# Altium project UHV Gate Valve Control.PrjPcb
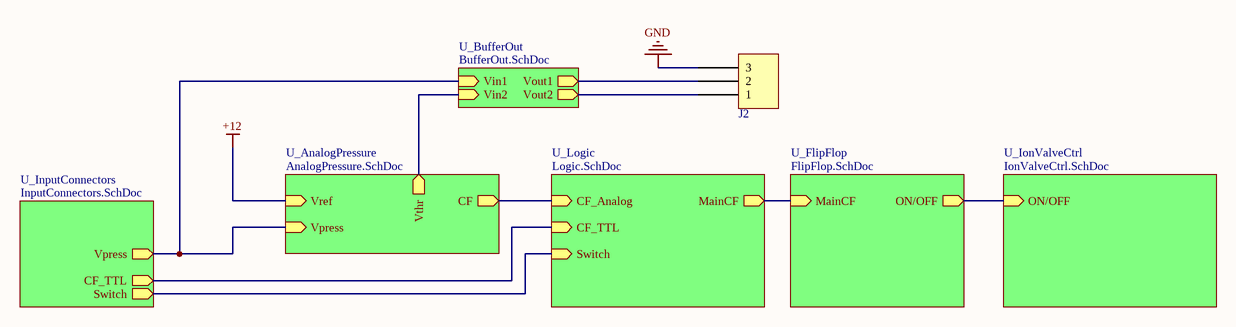
[diagram p0: MainSch.SchDoc]
7 sheets, 69 parts. Net scope: hierarchical (ports join the sheet entries above them; power ports are global).
Board file: UHVValveCtrlv1.PcbDoc
Sheets:
  MainSch.SchDoc
    U_AnalogPressure = AnalogPressure.SchDoc
    U_InputConnectors = InputConnectors.SchDoc
    U_Logic = Logic.SchDoc
    U_FlipFlop = FlipFlop.SchDoc
    U_IonValveCtrl = IonValveCtrl.SchDoc
    U_BufferOut = BufferOut.SchDoc

## Sheet MainSch.SchDoc
size A

### Parts
J2  0022272031  [MOLEX KK 0022272031]  (value not drawn)

### Sub-sheets
U_AnalogPressure = AnalogPressure.SchDoc: Vref (in), Vpress (in), CF (out), Vthr (out)
U_BufferOut = BufferOut.SchDoc: Vin1 (in), Vin2 (in), Vout1 (out), Vout2 (out)
U_FlipFlop = FlipFlop.SchDoc: MainCF (in), ON/OFF (out)
U_InputConnectors = InputConnectors.SchDoc: CF_TTL (out), Vpress (out), Switch (out)
U_IonValveCtrl = IonValveCtrl.SchDoc: ON/OFF (in)
U_Logic = Logic.SchDoc: CF_Analog (in), CF_TTL (in), Switch (in), MainCF (out)

### Nets
GND: J2.3
ON/OFF: sheet U_FlipFlop/ON/OFF, sheet U_IonValveCtrl/ON/OFF
NetC5_1: sheet U_InputConnectors/CF_TTL, sheet U_Logic/CF_TTL
NetC12_1: sheet U_Logic/MainCF, sheet U_FlipFlop/MainCF
NetINT_SWITCH_2: sheet U_InputConnectors/Switch, sheet U_Logic/Switch
NetJ1_2: sheet U_AnalogPressure/Vpress, sheet U_InputConnectors/Vpress, sheet U_BufferOut/Vin1
NetJ2_1: J2.1 ; sheet U_BufferOut/Vout2
NetJ2_2: J2.2 ; sheet U_BufferOut/Vout1
NetR1_1: sheet U_AnalogPressure/CF, sheet U_Logic/CF_Analog
NetR2_2: sheet U_AnalogPressure/Vthr, sheet U_BufferOut/Vin2

### Library data of the parts
J2 = 0022272031: CONN HEADER 3POS .100 VERT TIN; Manufacturer: Molex, LLC; Pitch: 0.100" (2.54mm); Number Of Positions: 3; Part Number: 0022272031; PartId: 9720; Supplier 1: Digi-Key; Supplier Part Number 1: WM4112-ND; ComponentLink1Description: Datasheet; ComponentLink1URL: http://www.molex.com/pdm_docs/sd/022272031_sd.pdf; ComponentLink2Description: Digi-Key Listing; ComponentLink2URL: http://www.digikey.com/product-search/en?keywords=22-27-2031; Price: 0.35; Type: Header, Unshrouded; Contact Finish: Tin; Fastening Type: Friction Lock; Number Of Rows: 1; Colour: Natural; Series: KK 6410

## Sheet AnalogPressure.SchDoc
size A
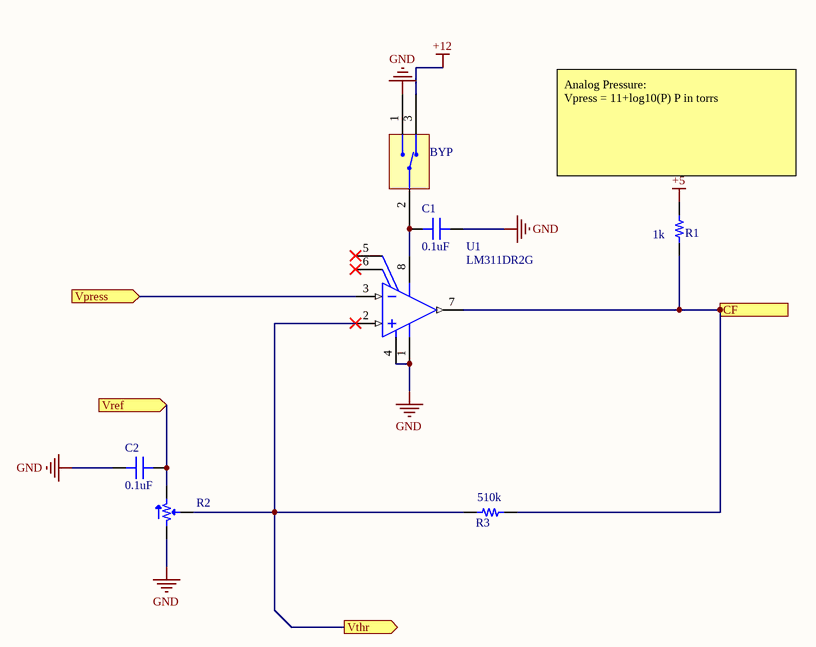
[diagram p1: AnalogPressure.SchDoc]

### Parts
BYP  CL-SB-12B-01T  [SW_CL-SB-12B-01]  (value not drawn)
C1  0.1uF  [CAP 0805/2012]
C2  0.1uF  [CAP 0805/2012]
R1  1k  [RES 1206/3216]
R2  20k  [POT MODEL91A]  (value not drawn)
R3  510k  [RES 1206/3216]
U1  LM311DR2G  [ONSC-SOIC-8-751-07_V]

### Ports
CF (out), Vpress (in), Vref (in), Vthr (out)

### Nets
+5: R1.2
+12: BYP.3(GND) C2.1 R2.3 ; port Vref
GND: BYP.1(GND) C1.2 C2.2 R2.1 U1.1(GND) U1.4(VEE)
NetBYP_2: BYP.2(GND) C1.1 U1.8(VCC)
NetJ1_2: U1.3(IN-) ; port Vpress
NetR1_1: R1.1 R3.2 U1.7(OUT) ; port CF
NetR2_2: R2.2 R3.1 U1.2(IN+) ; port Vthr

Not connected (* = marked no-connect by the designer): U1 5(BALANCE)* 6(BALANCE/STROBE)*

### Notes on the sheet
- (near R1) Analog Pressure:
  Vpress = 11+log10(P) P in torrs

### Library data of the parts
BYP = CL-SB-12B-01T: SWITCH SLIDE SPDT 200MA 12V; Manufacturer: Nidec Copal Electronics; Switch Function: On-On; Actuator Type: Standard; Switch Travel: 2.00mm; Mechanical Life: 10,000 Cycles; Part Number: CL-SB-12B-01T; PartId: 16472; Supplier 1: Digi-Key; Supplier Part Number 1: 563-1318-1-ND; ComponentLink1Description: Datasheet; ComponentLink1URL: https://www.nidec-copal-electronics.com/e/catalog/switch/cl-sb.pdf; ComponentLink2Description: Digi-Key Listing; ComponentLink2URL: https://www.digikey.com/product-detail/en/nidec-copal-electronics/CL-SB-12B-01T/563-1318-1-ND/3507878; Price: 0.9; TYPE: Slide Switches; Series: CL-SB; Circuit: SPDT; Operating Temperature: -40°C ~ 85°C
C1 C2 = CL21B104KACNNNC: CAP CER 0.1UF 25V X7R 0805; Manufacturer: Samsung Electro-Mechanics America, Inc.; TemperatureRange: -55C ~ 125C; Tolerance: 10%; Value: 0.1uF; Part Number: CL21B104KACNNNC; PartId: 5699; Supplier 1: Digi-Key; Supplier Part Number 1: 1276-1099-2-ND; ComponentLink1Description: Datasheet; ComponentLink1URL: http://www.samsungsem.com/kr/support/product-search/mlcc/CL21B104KACNNNC.jsp; ComponentLink2Description: Digi-Key listing; ComponentLink2URL: http://digikey.com/product-detail/en/CL21B104KACNNNC/1276-1099-2-ND/3886757; TemperatureCoefficient: X7R; Voltage: 25V; Price: 0.0099; Device Package: 0805 (2012 Metric); Type: -
R1 = ERJ-8ENF1001V: RES SMD 1K OHM 1% 1/4W 1206; Manufacturer: Panasonic Electronic Components; TemperatureRange: -55C ~ 155C; TemperatureCoefficient: 100ppm/C; PowerRating: 0.25W, 1/4W; Value: 1k; Part Number: ERJ-8ENF1001V; PartId: 2958; Supplier 1: Digi-Key; Supplier Part Number 1: P1.00KFTR-ND; ComponentLink1Description: Datasheet; ComponentLink1URL: http://industrial.panasonic.com/www-cgi/jvcr13pz.cgi?E+PZ+3+AOA0002+ERJ8ENF1001V+7+WW; ComponentLink2Description: Digi-Key listing; ComponentLink2URL: http://digikey.com/product-detail/en/ERJ-8ENF1001V/P1.00KFTR-ND/86206; Tolerance: 1%; Price: 0.0093; Type: Thick Film; Device Package: 1206 (3216 Metric)
R2 = 91AR20KLF: TRIMMER 20K OHM 3/8" CERMET TH; Manufacturer: TT Electronics/BI; Tolerance: 20%; PowerRating: 0.5W, 1/2W; Number Of Turns: Single; Adjustment Type: Top Adjustment; Value: 20k; Part Number: 91AR20KLF; PartId: 7167; Supplier 1: Digi-Key; Supplier Part Number 1: 987-1170-ND; ComponentLink1Description: Datasheet; ComponentLink1URL: http://www.bitechnologies.com/pdfs/91.pdf; ComponentLink2Description: Digi-Key Listing; ComponentLink2URL: http://www.digikey.ca/product-detail/en/91AR20KLF/987-1170-ND/2408748; Price: 2.25; Type: Through Hole
R3 = ERJ-8GEYJ514V: RES SMD 510K OHM 5% 1/4W 1206; Manufacturer: Panasonic Electronic Components; TemperatureRange: -55C ~ 155C; TemperatureCoefficient: 200ppm/C; PowerRating: 0.25W, 1/4W; Value: 510k; Part Number: ERJ-8GEYJ514V; PartId: 11855; Supplier 1: Digi-Key; Supplier Part Number 1: P510KETR-ND; ComponentLink1Description: Datasheet; ComponentLink1URL: http://industrial.panasonic.com/www-cgi/jvcr13pz.cgi?E+PZ+3+AOA0001+ERJ8GEYJ514V+7+WW; ComponentLink2Description: Digi-Key Listing; ComponentLink2URL: https://www.digikey.com/product-detail/en/panasonic-electronic-components/ERJ-8GEYJ514V/P510KETR-ND/21336; Tolerance: 5%; Price: 0.0045; Device Package: 1206 (3216 Metric)
U1 = CMP-1305-00058-1: Single Comparator, 5 to 30 V, 0 to 70 degC, 8-Pin SOIC, Pb-Free, Tape and Reel; Manufacturer: On Semiconductor; VCC Max (V): 30; VCC Min (V): 5; ICC Typ (mA): 2.4; ComponentLink3Description: Package Specification; ComponentLink1URL: http://www.onsemi.com/; ComponentLink1Description: Manufacturer URL; Mounting Technology: Surface Mount; PackageDescription: 8-Pin Small Outline Integrated Circuit, Body 4.9 x 3.9 mm, Pitch 1.27 mm; ComponentLink2Description: Datasheet; RoHS: TRUE; ComponentLink2URL: http://www.onsemi.com/pub_link/Collateral/LM211-D.PDF; PackageVersion: Rev. AK, 02/2011; PackageReference: SOIC-8-751-07; DatasheetVersion: Rev. 6; Packing: Tape and Reel; ComponentLink3URL: http://www.onsemi.com/pub_link/Collateral/751-07.PDF; PartNumber: LM311DR2G

## Sheet InputConnectors.SchDoc
size A
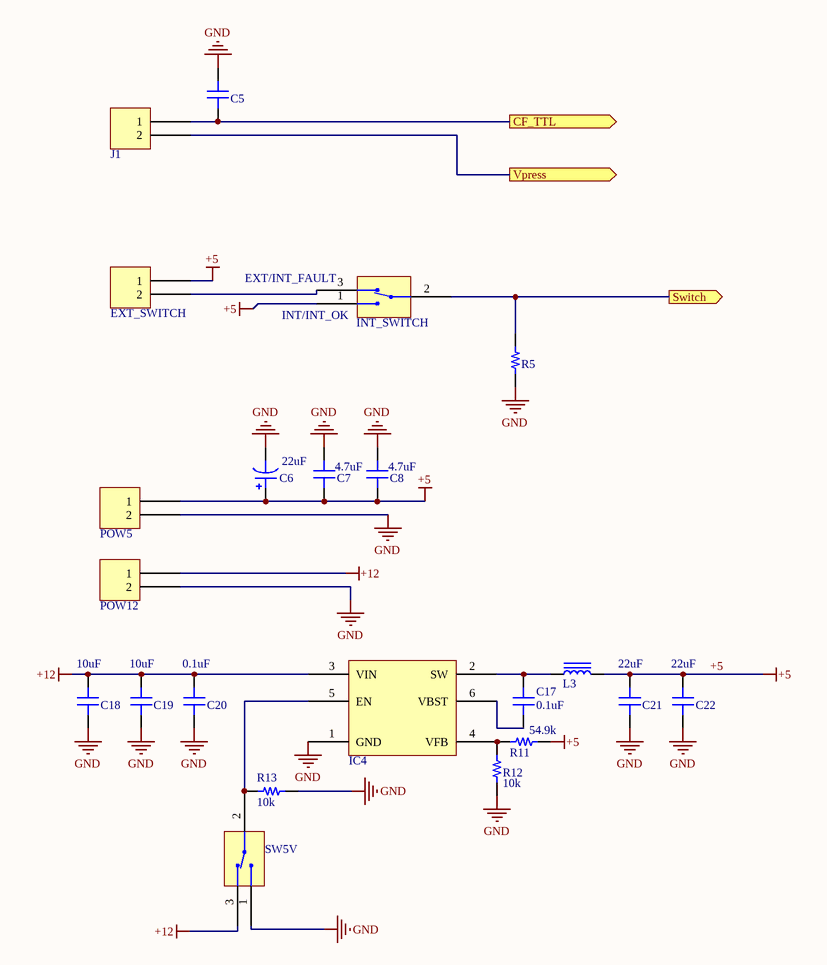
[diagram p2: InputConnectors.SchDoc]

### Parts
C5  10000pF  [CAP 0805/2012]  (value not drawn)
C6  22uF  [CAP AL TH D8 L3.5 H11.5]
C7  4.7uF  [CAP 1206/3216 - 1.0MM]
C8  4.7uF  [CAP 1206/3216 - 1.0MM]
C17  0.1uF  [CAP 0805/2012]
C18  10uF  [CAP 1206/3216]
C19  10uF  [CAP 1206/3216]
C20  0.1uF  [CAP 0805/2012]
C21  22uF  [CAP 1206/3216]
C22  22uF  [CAP 1206/3216]
EXT_SWITCH  282834-2  [TE 282834-2]  (value not drawn)
IC4  TPS563201DDCT  [TI SOT-23-6 DDC]  (value not drawn)
INT_SWITCH  CL-SB-12B-01T  [SW_CL-SB-12B-01]  (value not drawn)
J1  282834-2  [TE 282834-2]  (value not drawn)
L3  3.3uH  [WURTH WE-HCI 7050]  (value not drawn)
POW5  282834-2  [TE 282834-2]  (value not drawn)
POW12  282834-2  [TE 282834-2]  (value not drawn)
R5  10k  [RES 1206/3216]  (value not drawn)
R11  54.9k  [RES 0805/2012]
R12  10k  [RES 0805/2012]
R13  10k  [RES 0805/2012]
SW5V  CL-SB-12B-01T  [SW_CL-SB-12B-01]  (value not drawn)

### Ports
CF_TTL (out), Switch (out), Vpress (out)

### Nets
+5: C6.1 C7.1 C8.1 C21.2 C22.2 EXT_SWITCH.1 INT_SWITCH.1(GND) L3.2 POW5.1 R11.2
+12: C18.2 C19.2 C20.2 IC4.3(VIN) POW12.1 SW5V.3(GND)
GND: C5.2 C6.2 C7.2 C8.2 C18.1 C19.1 C20.1 C21.1 C22.1 IC4.1(GND) POW5.2 POW12.2 R5.1 R12.1 R13.1 SW5V.1(GND)
NetC5_1: C5.1 J1.1 ; port CF_TTL
NetC17_1: C17.1 IC4.6(VBST)
NetC17_2: C17.2 IC4.2(SW) L3.1
NetEXT_SWITCH_2: EXT_SWITCH.2 INT_SWITCH.3(GND)
NetIC4_4: IC4.4(VFB) R11.1 R12.2
NetIC4_5: IC4.5(EN) R13.2 SW5V.2(GND)
NetINT_SWITCH_2: INT_SWITCH.2(GND) R5.2 ; port Switch
NetJ1_2: J1.2 ; port Vpress

### Notes on the sheet
- (near INT_SWITCH) EXT/INT_FAULT
- (near INT_SWITCH) INT/INT_OK

### Library data of the parts
C5 = CL21B103KAANNNC: CAP CER 10000PF 25V X7R 0805; Manufacturer: Samsung Electro-Mechanics America, Inc.; TemperatureRange: -55C ~ 125C; Tolerance: 10%; Value: 10000pF; Part Number: CL21B103KAANNNC; PartId: 5695; Supplier 1: Digi-Key; Supplier Part Number 1: 1276-2434-2-ND; ComponentLink1Description: Datasheet; ComponentLink1URL: http://www.samsungsem.com/kr/support/product-search/mlcc/CL21B103KAANNNC.jsp; ComponentLink2Description: Digi-Key listing; ComponentLink2URL: http://digikey.com/product-detail/en/CL21B103KAANNNC/1276-2434-2-ND/3888092; TemperatureCoefficient: X7R; Voltage: 25V; Price: 0.0081; Type: -; Device Package: 0805 (2012 Metric)
C6 = EEU-FC2A220: CAP ALUM 22UF 20% 100V RADIAL; Manufacturer: Panasonic Electronic Components; TemperatureRange: -55°C ~ 105°C; Type: Automotive; Ripple Current: 169mA; Lifetime @ Temp: 2000 Hrs @ 105°C; Value: 22uF; Part Number: EEU-FC2A220; PartId: 7484; Supplier 1: Digi-Key; Supplier Part Number 1: P10770-ND; ComponentLink1Description: Datasheet; ComponentLink1URL: https://industrial.panasonic.com/ww/products/capacitors/aluminum-capacitors/aluminum-cap-lead/fc/EEUFC2A220; ComponentLink2Description: Digi-Key listing; ComponentLink2URL: https://www.digikey.com/product-detail/en/panasonic-electronic-components/EEU-FC2A220/P10770-ND/285722; Tolerance: 20%; Voltage: 100V; Price: 0.46; Device Package: Radial, Can - TH
C7 C8 = C3216X5R1H475K085AB: CAP CER 4.7UF 50V X5R 1206; Manufacturer: TDK Corporation; TemperatureRange: -55C ~ 85C; Tolerance: 10%; Value: 4.7uF; Part Number: C3216X5R1H475K085AB; PartId: 17022; Supplier 1: Digi-Key; Supplier Part Number 1: 445-14692-2-ND; ComponentLink1Description: Datasheet; ComponentLink1URL: https://product.tdk.com/info/en/catalog/datasheets/mlcc_commercial_general_en.pdf; ComponentLink2Description: Digi-Key Listing; ComponentLink2URL: https://www.digikey.com/product-detail/en/tdk-corporation/C3216X5R1H475K085AB/445-14692-2-ND/3951928; TemperatureCoefficient: X5R; Voltage: 50V; Price: 0.3159; Device Package: 1206 (3216 Metric)
C17 C20 = CL21B104KACNNNC: as C1 on sheet AnalogPressure; Value: 0.1uF; Part Number: CL21B104KACNNNC; PartId: 5699; Supplier 1: Digi-Key; Supplier Part Number 1: 1276-1099-2-ND; ComponentLink1Description: Datasheet; ComponentLink1URL: http://www.samsungsem.com/kr/support/product-search/mlcc/CL21B104KACNNNC.jsp; ComponentLink2Description: Digi-Key listing; ComponentLink2URL: http://digikey.com/product-detail/en/CL21B104KACNNNC/1276-1099-2-ND/3886757; TemperatureCoefficient: X7R; Voltage: 25V; Price: 0.0099; Device Package: 0805 (2012 Metric); Type: -
C18 C19 = C1206C106M3RACTU: CAP CER 10UF 25V X7R 1206; Manufacturer: Kemet; TemperatureRange: -55C ~ 125C; Tolerance: 20%; Value: 10uF; Part Number: C1206C106M3RACTU; PartId: 6235; Supplier 1: Digi-Key; Supplier Part Number 1: 399-7443-2-ND; ComponentLink1Description: Datasheet; ComponentLink1URL: http://www.kemet.com/docfinder?Partnumber=C1206C106M3RACTU; ComponentLink2Description: Digi-Key listing; ComponentLink2URL: http://digikey.com/product-detail/en/C1206C106M3RACTU/399-7443-2-ND/3317649; TemperatureCoefficient: X7R; Voltage: 25V; Price: 0.2272; Type: -; Device Package: 1206 (3216 Metric)
C21 C22 = CL31A226KAHNNNE: CAP CER 22UF 25V X5R 1206; Manufacturer: Samsung Electro-Mechanics America, Inc.; TemperatureRange: -55C ~ 85C; Tolerance: 10%; Value: 22uF; Part Number: CL31A226KAHNNNE; PartId: 15794; Supplier 1: Digi-Key; Supplier Part Number 1: 1276-3047-2-ND; ComponentLink1Description: Datasheet; ComponentLink1URL: //media.digikey.com/pdf/Data%20Sheets/Samsung%20PDFs/CL31A226KAHNNNE_Spec.pdf; ComponentLink2Description: Digi-Key Listing; ComponentLink2URL: https://www.digikey.com/product-detail/en/samsung-electro-mechanics-america-inc/CL31A226KAHNNNE/1276-3047-2-ND/3888705; TemperatureCoefficient: X5R; Voltage: 25V; Price: 0.1785; Device Package: 1206 (3216 Metric)
EXT_SWITCH J1 POW5 POW12 = 282834-2: TERM BLOCK 2POS SIDE ENT 2.54MM; Manufacturer: TE Connectivity AMP Connectors; TemperatureRange: -40C ~ 105C; Voltage: 150V; Pitch: 0.100" (2.54mm); Number Of Levels: 1; Positions Per Level: 2; Part Number: 282834-2; PartId: 9289; Supplier 1: Digi-Key; Supplier Part Number 1: A98333-ND; ComponentLink1Description: Datasheet; ComponentLink1URL: http://www.te.com/commerce/DocumentDelivery/DDEController?Action=srchrtrv&DocNm=282834&DocType=Customer+Drawing&DocLang=English; ComponentLink2Description: Digi-Key Listing; ComponentLink2URL: http://www.digikey.ca/product-detail/en/282834-2/A98333-ND/1150135; Price: 1.3; Colour: Green; Orientation: Horizontal with Board
IC4 = TPS563201DDCT: IC REG BUCK ADJ 3A SYNC; Manufacturer: Texas Instruments; Function: Step-Down; Output Configuration: Positive; Output Type: Adjustable; Number Of Outputs: 1; Voltage - Input (Min): 4.5V; Voltage - Input (Max): 17V; Voltage - Output (Min/Fixed): 0.768V; Voltage - Output (Max): 7V; Frequency - Switching: 580kHz; Synchronous Rectifier: Yes; Part Number: TPS563201DDCT; PartId: 16367; Supplier 1: Digi-Key; Supplier Part Number 1: 296-43393-2-ND; ComponentLink1Description: Datasheet; ComponentLink1URL: http://www.ti.com/lit/ds/symlink/tps563201.pdf; ComponentLink2Description: Digi-Key Listing; ComponentLink2URL: http://www.digikey.com/product-detail/en/texas-instruments/TPS563201DDCT/296-43393-2-ND/5813458; Device Package: SOT-23-6 Thin, TSOT-23-6; Price: 0.8901; Type: DC DC Switching Regulators; Series: D-CAP2, Eco-Mode; Operating Temperature: -45C ~ 125C (TJ); Topology: Buck; Current Output: 3A
INT_SWITCH SW5V = CL-SB-12B-01T: as BYP on sheet AnalogPressure; Part Number: CL-SB-12B-01T; PartId: 16472; Supplier 1: Digi-Key; Supplier Part Number 1: 563-1318-1-ND; ComponentLink1Description: Datasheet; ComponentLink1URL: https://www.nidec-copal-electronics.com/e/catalog/switch/cl-sb.pdf; ComponentLink2Description: Digi-Key Listing; ComponentLink2URL: https://www.digikey.com/product-detail/en/nidec-copal-electronics/CL-SB-12B-01T/563-1318-1-ND/3507878; Price: 0.9; TYPE: Slide Switches; Series: CL-SB; Circuit: SPDT; Operating Temperature: -40°C ~ 85°C
L3 = 744314330: FIXED IND 3.3UH 9A 9 MOHM SMD; Manufacturer: Wurth Electronics Inc; Type: Wirewound; Tolerance: 20%; Shielding: Shielded; DC Resistance (DCR): 9 mOhm; Frequency - Self Resonant: 65MHz; Value: 3.3uH; Part Number: 744314330; PartId: 9675; Supplier 1: Digi-Key; Supplier Part Number 1: 732-1160-2-ND; ComponentLink1Description: Datasheet; ComponentLink1URL: http://katalog.we-online.de/pbs/datasheet/744314330.pdf; ComponentLink2Description: Digi-Key Listing; ComponentLink2URL: https://www.digikey.com/product-detail/en/744314330/732-1160-2-ND/1638565; Price: 2.85; Device Package: Nonstandard; Series: WE-HCI; Inductance: 3.3uH; Current Rating: 9A; Q @ Freq: -; Operating Temperature: -40C ~ 150C
R5 = ERJ-8ENF1002V: RES SMD 10K OHM 1% 1/4W 1206; Manufacturer: Panasonic Electronic Components; TemperatureRange: -55C ~ 155C; TemperatureCoefficient: 100ppm/C; PowerRating: 0.25W, 1/4W; Value: 10k; Part Number: ERJ-8ENF1002V; PartId: 2956; Supplier 1: Digi-Key; Supplier Part Number 1: P10.0KFTR-ND; ComponentLink1Description: Datasheet; ComponentLink1URL: http://industrial.panasonic.com/www-cgi/jvcr13pz.cgi?E+PZ+3+AOA0002+ERJ8ENF1002V+7+WW; ComponentLink2Description: Digi-Key listing; ComponentLink2URL: http://digikey.com/product-detail/en/ERJ-8ENF1002V/P10.0KFTR-ND/89059; Tolerance: 1%; Price: 0.0093; Type: Thick Film; Device Package: 1206 (3216 Metric)
R11 = ERJ-P06D5492V: RES SMD 54.9K OHM 0.5% 1/2W 0805; Manufacturer: Panasonic Electronic Components; TemperatureRange: -55C ~ 155C; TemperatureCoefficient: 100ppm/C; PowerRating: 0.5W, 1/2W; Value: 54.9k; Part Number: ERJ-P06D5492V; PartId: 12299; Supplier 1: Digi-Key; Supplier Part Number 1: P16052TR-ND; ComponentLink1Description: Datasheet; ComponentLink1URL: //media.digikey.com/pdf/Data%20Sheets/Panasonic%20Electronic%20Components/ERJ_PA2_P03_PA3_P06_P08_P14.pdf; ComponentLink2Description: Digi-Key Listing; ComponentLink2URL: https://www.digikey.com/product-detail/en/panasonic-electronic-components/ERJ-P06D5492V/P16052TR-ND/3982693; Tolerance: 0.5%; Price: 0.0342; Device Package: 0805 (2012 Metric)
R12 R13 = ERJ-P06F1002V: RES SMD 10K OHM 1% 1/2W 0805; Manufacturer: Panasonic Electronic Components; TemperatureRange: -55C ~ 155C; TemperatureCoefficient: 100ppm/C; PowerRating: 0.5W, 1/2W; Value: 10k; Part Number: ERJ-P06F1002V; PartId: 12237; Supplier 1: Digi-Key; Supplier Part Number 1: P16059TR-ND; ComponentLink1Description: Datasheet; ComponentLink1URL: //media.digikey.com/pdf/Data%20Sheets/Panasonic%20Electronic%20Components/ERJ_PA2_P03_PA3_P06_P08_P14.pdf; ComponentLink2Description: Digi-Key Listing; ComponentLink2URL: https://www.digikey.com/product-detail/en/panasonic-electronic-components/ERJ-P06F1002V/P16059TR-ND/3982700; Tolerance: 1%; Price: 0.0192; Device Package: 0805 (2012 Metric)

## Sheet Logic.SchDoc
size A
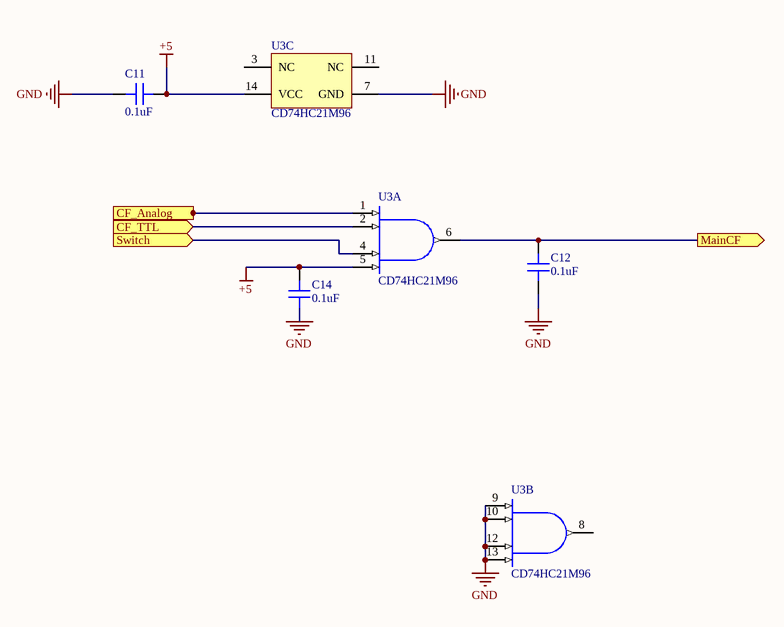
[diagram p3: Logic.SchDoc]

### Parts
C11  0.1uF  [CAP 0805/2012]
C12  0.1uF  [CAP 0805/2012]
C14  0.1uF  [CAP 0805/2012]
U3  CD74HC21M96  [D0014A_N]  (parts A,B,C of 3)

### Ports
CF_Analog (in), CF_TTL (in), MainCF (out), Switch (in)

### Nets
+5: C11.1 C14.1 U3.5(1D) U3.14(VCC)
GND: C11.2 C12.2 C14.2 U3.7(GND) U3.9(2A) U3.10(2B) U3.12(2C) U3.13(2D)
NetC5_1: U3.2(1B) ; port CF_TTL
NetC12_1: C12.1 U3.6(1Y) ; port MainCF
NetINT_SWITCH_2: U3.4(1C) ; port Switch
NetR1_1: U3.1(1A) ; port CF_Analog

Not connected (* = marked no-connect by the designer): U3 3(NC) 8(2Y) 11(NC)

### Library data of the parts
C11 C12 C14 = CL21B104KACNNNC: as C1 on sheet AnalogPressure; Value: 0.1uF; Part Number: CL21B104KACNNNC; PartId: 5699; Supplier 1: Digi-Key; Supplier Part Number 1: 1276-1099-2-ND; ComponentLink1Description: Datasheet; ComponentLink1URL: http://www.samsungsem.com/kr/support/product-search/mlcc/CL21B104KACNNNC.jsp; ComponentLink2Description: Digi-Key listing; ComponentLink2URL: http://digikey.com/product-detail/en/CL21B104KACNNNC/1276-1099-2-ND/3886757; TemperatureCoefficient: X7R; Voltage: 25V; Price: 0.0099; Device Package: 0805 (2012 Metric); Type: -
U3 = CMP-0777-00096-3: High Speed CMOS Logic Dual 4-Input AND Gates, D0014A, LARGE T&R; Manufacturer: Texas Instruments; Rating: Catalog; F @ Nom Voltage(Max)(Mhz): 70; Output Drive (IOL/IOH)(Max)(mA): -5.2/5.2; Technology Family: HC; Bits(#): 2; Voltage(Nom)(V): 5; ICC @ Nom Voltage(Max)(mA): 0.02; Schmitt Trigger: No; tpd @ Nom Voltage(Max)(ns): 28; VCC(Max)(V): 6; Operating Temperature Range(C): -55 to 125; Input Type: CMOS; DatasheetVersion: SCHS131C; Generic Part Number: CD74HC21; PackageReference: D0014A; VCC(Min)(V): 2; Output Type: CMOS

## Sheet FlipFlop.SchDoc
size A
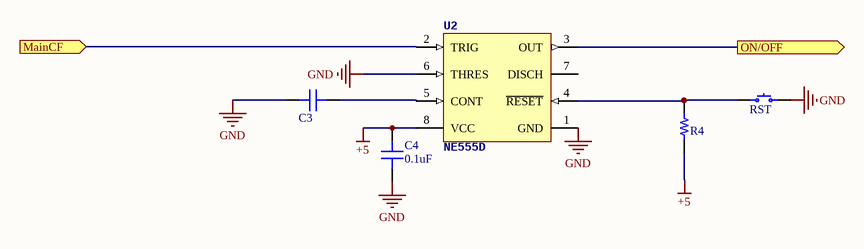
[diagram p4: FlipFlop.SchDoc]

### Parts
C3  10000pF  [CAP 0805/2012]  (value not drawn)
C4  0.1uF  [CAP 0805/2012]
R4  10k  [RES 1206/3216]  (value not drawn)
RST  AB11AH-HC  [NKK AB11AH-HC]  (value not drawn)
U2  NE555D  [D0008A_L]

### Ports
MainCF (in), ON/OFF (out)

### Nets
+5: C4.2 R4.2 U2.8(VCC)
GND: C3.1 C4.1 RST.3 U2.1(GND) U2.6(THRES)
ON/OFF: U2.3(OUT) ; port ON/OFF
NetC3_2: C3.2 U2.5(CONT)
NetC12_1: U2.2(TRIG) ; port MainCF
NetR4_1: R4.1 RST.1 U2.4(~{RESET})

Not connected (* = marked no-connect by the designer): U2 7(DISCH)

### Library data of the parts
C3 = CL21B103KAANNNC: as C5 on sheet InputConnectors; Value: 10000pF; Part Number: CL21B103KAANNNC; PartId: 5695; Supplier 1: Digi-Key; Supplier Part Number 1: 1276-2434-2-ND; ComponentLink1Description: Datasheet; ComponentLink1URL: http://www.samsungsem.com/kr/support/product-search/mlcc/CL21B103KAANNNC.jsp; ComponentLink2Description: Digi-Key listing; ComponentLink2URL: http://digikey.com/product-detail/en/CL21B103KAANNNC/1276-2434-2-ND/3888092; TemperatureCoefficient: X7R; Voltage: 25V; Price: 0.0081; Type: -; Device Package: 0805 (2012 Metric)
C4 = CL21B104KACNNNC: as C1 on sheet AnalogPressure; Value: 0.1uF; Part Number: CL21B104KACNNNC; PartId: 5699; Supplier 1: Digi-Key; Supplier Part Number 1: 1276-1099-2-ND; ComponentLink1Description: Datasheet; ComponentLink1URL: http://www.samsungsem.com/kr/support/product-search/mlcc/CL21B104KACNNNC.jsp; ComponentLink2Description: Digi-Key listing; ComponentLink2URL: http://digikey.com/product-detail/en/CL21B104KACNNNC/1276-1099-2-ND/3886757; TemperatureCoefficient: X7R; Voltage: 25V; Price: 0.0099; Device Package: 0805 (2012 Metric); Type: -
R4 = ERJ-8ENF1002V: as R5 on sheet InputConnectors; Value: 10k; Part Number: ERJ-8ENF1002V; PartId: 2956; Supplier 1: Digi-Key; Supplier Part Number 1: P10.0KFTR-ND; ComponentLink1Description: Datasheet; ComponentLink1URL: http://industrial.panasonic.com/www-cgi/jvcr13pz.cgi?E+PZ+3+AOA0002+ERJ8ENF1002V+7+WW; ComponentLink2Description: Digi-Key listing; ComponentLink2URL: http://digikey.com/product-detail/en/ERJ-8ENF1002V/P10.0KFTR-ND/89059; Tolerance: 1%; Price: 0.0093; Type: Thick Film; Device Package: 1206 (3216 Metric)
RST = AB11AH-HC: SWITCH PUSH SPST-NO 0.4VA 28V; Manufacturer: NKK Switches; Switch Function: Off-Mom; Actuator Type: Round, Button; Mechanical Life: 50,000 Cycles; Part Number: AB11AH-HC; PartId: 16763; Supplier 1: Digi-Key; Supplier Part Number 1: 360-2604-ND; ComponentLink1Description: Datasheet; ComponentLink1URL: http://2t70un3m1d9z1kztamkdrd38.wpengine.netdna-cdn.com/wp-content/uploads/2016/02/Apushbuttons-2.pdf; ComponentLink2Description: Digi-Key Listing; ComponentLink2URL: http://www.digikey.com/product-detail/en/nkk-switches/AB11AH-HC/360-2604-ND/1056046; Price: 5; TYPE: Standard; Series: AB; Circuit: SPST-NO; Illumination Voltage: -; Illumination Type, Colour: -; Operating Temperature: -30C ~ 85C
U2 = CMP-2000-06840-1: Precision Timer, 4.5 to 16 V, 0 to 70 degC, 8-Pin SOIC (D), Green (RoHS & no Sb/Br), Tube; PartNumber: NE555; Manufacturer: Texas Instruments; Base Number: 555; No. of Timers: 1; Supply Voltage Min: 4.5V; Operating Frequency Max: 0.5MHz; Supply Voltage Range: 4.5Vto16V; No. of Pins: 8; Supply Voltage Max: 16V; IC Temperature Range: Commercial; SVHC: NoSVHC(19-Dec-2012); Operating Mode: Astable,Monostable; Frequency: 500kHz; Package Description: 8-Pin Small Outline Integrated Circuit, Body 4.9 x 3.9 mm, Pitch 1.27 mm; Datasheet URL: http://www.ti.com/general/docs/lit/getliterature.tsp?genericPartNumber=NE555&fileType=pdf; Mounting Technology: SurfaceMount; Operating Temperature Range: 0°Cto+70°C; Operating Temperature Min: 0°C; Package URL: http://www.ti.com/lit/ml/msoi002j/msoi002j.pdf; Datasheet Version: Rev. I, 09/2014; Manufacturer URL: http://www.ti.com/; Digital IC Case Style: SOIC; Clock External Input: No; Logic Function Number: 555; IC Generic Number: 555; No. of Channels: 1; Operating Temperature Max: 70°C; Package / Case: SOIC; Package Reference: D8; Device Marking: NE555D

## Sheet IonValveCtrl.SchDoc
size A
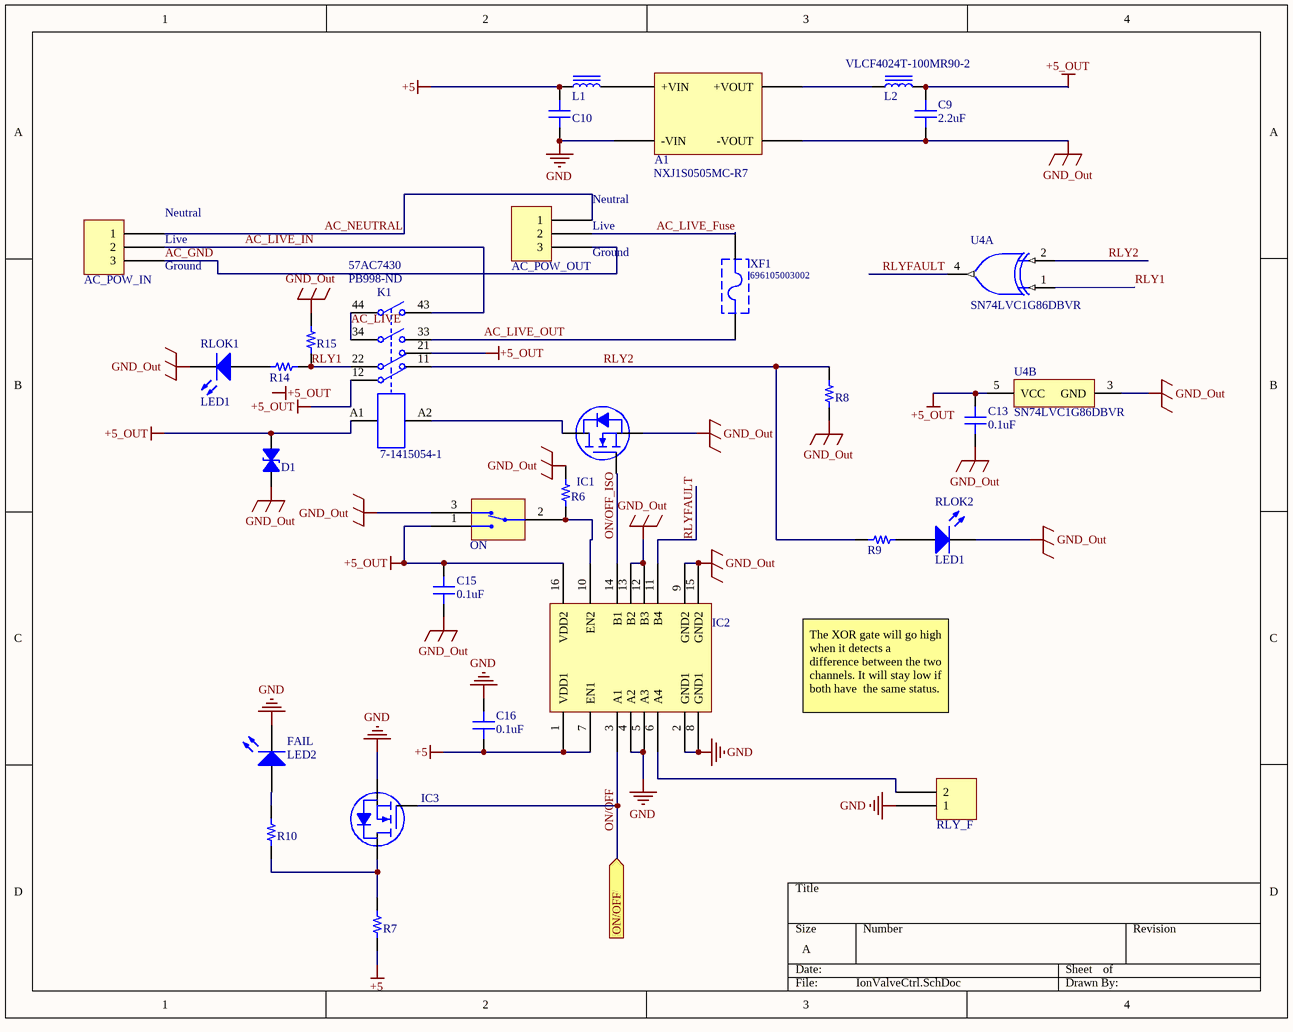
[diagram p5: IonValveCtrl.SchDoc]

### Parts
A1  NXJ1S0505MC-R7  [MURATA NXJ1]
AC_POW_IN  691508110303  [WURTH 691508110303]  (value not drawn)
AC_POW_OUT  691508110303  [WURTH 691508110303]  (value not drawn)
C9  2.2uF  [CAP 1206/3216]
C10  4.7uF  [CAP 1206/3216 - 1.8MM]  (value not drawn)
C13  0.1uF  [CAP 0805/2012]
C15  0.1uF  [CAP 0805/2012]
C16  0.1uF  [CAP 0805/2012]
D1  SM15T15CA  [ST DO214AB SMC]  (value not drawn)
FAIL  LED2  [LED-1]
IC1  BSS138WH6327XTSA1  [INFINEON SOT-323-3]  (value not drawn)
IC2  SI8641BB-B-IS  [SI LABS SOIC-16 WIDE]  (value not drawn)
IC3  BSS138WH6327XTSA1  [INFINEON SOT-323-3]  (value not drawn)
K1  7-1415054-1  Supplier Part Number 1: PB998-ND  Supplier Part Number 2: 57AC7430  [TECO-3-1415055-1-10_V]
L1  VLCF4024T-4R7N1R4-2  [TDK VLCF4024-2]  (value not drawn)
L2  VLCF4024T-100MR90-2  [TDK VLCF4024-2]
ON  CL-SB-12B-01T  [SW_CL-SB-12B-01]  (value not drawn)
R6  10k  [RES 1206/3216]  (value not drawn)
R7  620  [RES 1206/3216]  (value not drawn)
R8  10k  [RES 1206/3216]  (value not drawn)
R9  620  [RES 1206/3216]  (value not drawn)
R10  620  [RES 1206/3216]  (value not drawn)
R14  620  [RES 1206/3216]  (value not drawn)
R15  10k  [RES 1206/3216]  (value not drawn)
RLOK1  LED1  [LED-1]
RLOK2  LED1  [LED-1]
RLY_F  0022272021  [MOLEX KK 0022272021]  (value not drawn)
U4  SN74LVC1G86DBVR  [DBV0005A_L]  (parts A,B of 2)
XF1  696105003002  [696105003002]

### Ports
ON/OFF (in)

### Nets
+5: C10.2 C16.1 IC2.1(VDD1) IC2.7(EN1) L1.1 R7.1
+5_OUT: C9.1 C13.1 C15.1 D1.2 IC2.16(VDD2) K1.12 K1.21 K1.A1 L2.2 ON.1(GND) U4.5(VCC)
GND: A1.1(-VIN) C10.1 C16.2 FAIL.2(K) IC2.2(GND1) IC2.4(A2) IC2.5(A3) IC2.8(GND1) IC3.3(S) RLY_F.1
GND_Out: A1.7(-VOUT) C9.2 C13.2 C15.2 D1.1 IC1.3(S) IC2.9(GND2) IC2.12(B3) IC2.13(B2) IC2.15(GND2) ON.3(GND) R6.1 R8.2 R15.2 RLOK1.2(K) RLOK2.2(K) U4.3(GND)
AC_GND: AC_POW_IN.3 AC_POW_OUT.3
AC_LIVE: K1.34 K1.44
AC_LIVE_Fuse: AC_POW_OUT.2 XF1.2
AC_LIVE_IN: AC_POW_IN.2 K1.43
AC_LIVE_OUT: K1.33 XF1.1
AC_NEUTRAL: AC_POW_IN.1 AC_POW_OUT.1
ON/OFF: IC2.3(A1) IC3.1(G) ; port ON/OFF
ON/OFF_ISO: IC1.1(G) IC2.14(B1)
RLY1: K1.22 R14.2 R15.1 U4.1(A)
RLY2: K1.11 R8.1 R9.1 U4.2(B)
RLYFAULT: IC2.11(B4) U4.4(Y)
NetA1_3: A1.3(+VIN) L1.2
NetA1_8: A1.8(+VOUT) L2.1
NetFAIL_1: FAIL.1(A) R10.2
NetIC1_2: IC1.2(D) K1.A2
NetIC2_6: IC2.6(A4) RLY_F.2
NetIC2_10: IC2.10(EN2) ON.2(GND) R6.2
NetIC3_2: IC3.2(D) R7.2 R10.1
NetR9_2: R9.2 RLOK2.1(A)
NetR14_1: R14.1 RLOK1.1(A)

### Notes on the sheet
- (near AC_POW_IN) Neutral
- Neutral
- (near AC_POW_OUT) Live
- (near AC_POW_IN) Live
- (near AC_POW_IN) Ground
- (near AC_POW_OUT) Ground
- The XOR gate will go high when it detects a difference between the two channels. It will stay low if both have  the same status.
- Labels drawn without touching a wire or pin: +5_OUT

### Library data of the parts
A1 = NXJ1S0505MC-R7: DC/DC SM 1W 5V-5V SINGLE 4.2KV; Manufacturer: Murata Power Solutions Inc.; Number Of Outputs: 1; Voltage - Input (Min): 4.5V; Voltage - Input (Max): 5.5V; Voltage - Output 1: 5V; Current - Output (Max): 200mA; Voltage - Isolation: 4.2kV (4200V); Part Number: NXJ1S0505MC-R7; PartId: 14964; Supplier 1: Digi-Key; Supplier Part Number 1: 811-3094-1-ND; ComponentLink1Description: Datasheet; ComponentLink1URL: http://power.murata.com/data/power/ncl/kdc_nxj1.pdf; ComponentLink2Description: Digi-Key Listing; ComponentLink2URL: https://www.digikey.com/product-detail/en/murata-power-solutions-inc/NXJ1S0505MC-R7/811-3094-1-ND/5697921; Price: 3.55; Type: Isolated Module; Device Package: 14-SMD Module (5 Leads); Operating Temperature: -40C ~ 85C; Power (Watts): 1W
AC_POW_IN AC_POW_OUT = 691508110303: CONN TERM BLK 3POS 3.5MM BLACK; Manufacturer: Wurth Electronics Inc; TemperatureRange: -40C ~ 130C; Voltage: 300V; Pitch: 0.138" (3.50mm); Number Of Levels: 1; Positions Per Level: 3; Part Number: 691508110303; PartId: 16443; Supplier 1: Digi-Key; Supplier Part Number 1: 732-5964-2-ND; ComponentLink1Description: Datasheet; ComponentLink1URL: http://katalog.we-online.de/em/datasheet/6915081103xx.pdf; ComponentLink2Description: Digi-Key Listing; ComponentLink2URL: http://www.digikey.com/product-detail/en/wurth-electronics-inc/691508110303/732-5964-2-ND/5047809; Price: 2.334; Type: Terminal Blocks - Wire to Board; Colour: Black; Orientation: Horizontal and Vertical with Board
C9 = CL31B225KCHSNNE: CAP CER 2.2UF 100V X7R 1206; Manufacturer: Samsung Electro-Mechanics America, Inc.; TemperatureRange: -55C ~ 125C; Tolerance: 10%; Value: 2.2uF; Part Number: CL31B225KCHSNNE; PartId: 6260; Supplier 1: Digi-Key; Supplier Part Number 1: 1276-3138-2-ND; ComponentLink1Description: Datasheet; ComponentLink1URL: http://media.digikey.com/pdf/Data%20Sheets/Samsung%20PDFs/CL31B225KCHSNNE_Spec.pdf; ComponentLink2Description: Digi-Key listing; ComponentLink2URL: http://digikey.com/product-detail/en/CL31B225KCHSNNE/1276-3138-2-ND/3888796; TemperatureCoefficient: X7R; Voltage: 100V; Price: 0.3227; Type: -; Device Package: 1206 (3216 Metric)
C10 = CL31B475KPHNNNE: CAP CER 4.7UF 10V X7R 1206; Manufacturer: Samsung Electro-Mechanics America, Inc.; TemperatureRange: -55C ~ 125C; Tolerance: 10%; Value: 4.7uF; Part Number: CL31B475KPHNNNE; PartId: 17410; Supplier 1: Digi-Key; Supplier Part Number 1: 1276-1133-2-ND; ComponentLink1Description: Datasheet; ComponentLink1URL: http://www.samsungsem.com/kr/front/downloadcms.do?path=/kr/support/product-search/mlcc/__icsFiles/afieldfile/2014/11/05&fileName=C_CL31B475KPHNNNE.pdf; ComponentLink2Description: Digi-Key Listing; ComponentLink2URL: https://www.digikey.com/product-detail/en/samsung-electro-mechanics-america-inc/CL31B475KPHNNNE/1276-1133-2-ND/3886791; TemperatureCoefficient: X7R; Voltage: 10V; Price: 0.0761; Device Package: 1206 (3216 Metric)
C13 C15 C16 = CL21B104KACNNNC: as C1 on sheet AnalogPressure; Value: 0.1uF; Part Number: CL21B104KACNNNC; PartId: 5699; Supplier 1: Digi-Key; Supplier Part Number 1: 1276-1099-2-ND; ComponentLink1Description: Datasheet; ComponentLink1URL: http://www.samsungsem.com/kr/support/product-search/mlcc/CL21B104KACNNNC.jsp; ComponentLink2Description: Digi-Key listing; ComponentLink2URL: http://digikey.com/product-detail/en/CL21B104KACNNNC/1276-1099-2-ND/3886757; TemperatureCoefficient: X7R; Voltage: 25V; Price: 0.0099; Device Package: 0805 (2012 Metric); Type: -
D1 = SM15T15CA: TVS DIODE 12.8VWM 27.2VC SMC; Manufacturer: STMicroelectronics; Type: Zener; Bidirectional Channels: 1; Power - Peak Pulse: 1500W (1.5kW); Current - Peak Pulse: 368A (8/20us); Voltage (Clamping): 27.2V; Voltage (Breakdown): 14.3V; Voltage (Reverse Standoff): 12.8V; Part Number: SM15T15CA; PartId: 14821; Supplier 1: Digi-Key; Supplier Part Number 1: 497-7863-2-ND; ComponentLink1Description: Datasheet; ComponentLink1URL: http://www.st.com/web/en/resource/technical/document/datasheet/CD00000724.pdf; ComponentLink2Description: Digi-Key Listing; ComponentLink2URL: https://www.digikey.com/product-detail/en/stmicroelectronics/SM15T15CA/497-7863-2-ND/1039033; Operating Temperature: -55C ~ 150C (TJ); Price: 0.2798; Device Package: DO-214AB, SMC
FAIL RLOK1 RLOK2 = LED1: Typical RED GaAs LED; Published: 8-Jun-2000; LatestRevisionDate: 08-Jul-2005; LatestRevisionNote: Mech Layer 1 removed.; PackageReference: LED-1; Publisher: Altium Limited; PackageDescription: LED; 2 Leads
IC1 IC3 = BSS138WH6327XTSA1: MOSFET N-CH 60V 280MA SOT-323; Manufacturer: Infineon Technologies; Rds On (Max) at Id, Vgs: 3.5 Ohm @ 200mA, 10V; Vgs(th) (Max) at Id: 1.4V @ 26uA; Gate Charge (Qg): 1.5nC @ 10V; Input Capacitance (Ciss) at Vds: 43pF @ 25V; Power - Max: 500mW; Current Continuous Drain: 280mA (Ta); Part Number: BSS138WH6327XTSA1; PartId: 8084; Supplier 1: Digi-Key; Supplier Part Number 1: BSS138WH6327XTSA1TR-ND; ComponentLink1Description: Datasheet; ComponentLink1URL: http://www.infineon.com/dgdl/Infineon-BSS138W-DS-v02_43-en.pdf?fileId=db3a304335113a6301351e62fcb4131f; ComponentLink2Description: Digi-Key Listing; ComponentLink2URL: http://www.digikey.com/product-detail/en/BSS138WH6327XTSA1/BSS138WH6327XTSA1TR-ND/5410120; Price: 0.0483; Type: MOSFET N-Channel, Metal Oxide; Device Package: SC-70, SOT-323; Drain to Source Voltage (Vdss): 60V; Features: Logic Level Gate
IC2 = Si8641BB-B-IS: DGTL ISO 2.5KV GEN PURP 16SOIC; Manufacturer: Silicon Labs; Isolated Power: No; Number of Channels: 4; Inputs - Side 1/Side2: 3/1; Channel Type: Unidirectional; Voltage - Isolation: 2500Vrms; Common Mode Transient Immunity (Min): 35kV/us; Data Rate: 150Mbps; Propagation Delay tpLH/tpHL (Max): 13ns, 13ns; Pulse Width Distortion (Max): 4.5ns; Rise / Fall Time (Typ): 2.5ns, 2.5ns; Voltage - Supply: 2.5 V ~ 5.5 V; Part Number: SI8641BB-B-IS; PartId: 14408; Supplier 1: Digi-Key; Supplier Part Number 1: SI8641BB-B-IS-ND; ComponentLink1Description: Datasheet; ComponentLink1URL: http://www.silabs.com/Support%20Documents/TechnicalDocs/Si864x.pdf; ComponentLink2Description: Digi-Key Listing; ComponentLink2URL: https://www.digikey.com/product-detail/en/silicon-labs/SI8641BB-B-IS/SI8641BB-B-IS-ND/4576743; Price: 3.81; Type: General Purpose; Device Package: 16-SOIC (0.295", 7.50mm Width); Operating Temperature: -40C ~ 125C; Technology: Capacitive Coupling
K1 = CMP-1684-00019-1: Force Guided Relay SR4 D/M, 5 V, 8 A, -25 to 70 degC, 10-Pin THD, RoHS, Box and Tube; Manufacturer: TE Connectivity; Relay Construction: Non-Latching; Dropout Volt (Min): 2.4VDC; Coil Current: 33.33mA; Product Depth (mm): 13mm; LED Indicator: No; Product Height (mm): 16.5mm; Maximum Power Rating: 2KVA; Voltage Rating (VAC): 400V; Pick-up Voltage (Max): 18VDC; Coil Resistance: 720ohm; Coil Voltage DC: 24V; Product Length (mm): 40mm; Seal: Unsealed; Contact Arrangement: DPST-NO/DPST-NC; Contact Current Rating: 8A; Contact Form: 2FormA/2FormB; Datasheet Version: Rev. 0415; Type: SafetyRelay; Packaging: Tube; Operating Temp Range: -25Cto70C; Package / Case: DustCover; Pin Count: 10; Datasheet URL: http://www.te.com/commerce/DocumentDelivery/DDEController?Action=showdoc&DocId=Data+Sheet%7FSR4_D%2FM%7F0415%7Fpdf%7FEnglish%7FENG_DS_SR4_DXM_0415.pdf%7F3-1415055-1; Mounting Style: ThroughHole; Manufacturer URL: http://www.te.com; Coil Suppression Diode: No; Dropout Volt: 2.4VDC; Rad Hardened: No; Termination Style: PCPin; Package Description: 10-Pin Through Hole device, Body 40 x 13 mm; Package Reference: THD; Push To Test Button: No; Contact Material: AgSnO2; Supplier 1: Digi-Key; Supplier 2: Newark
L1 = VLCF4024T-4R7N1R4-2: FIXED IND 4.7UH 1.43A 87 MOHM; Manufacturer: TDK Corporation; Type: Wirewound; Material - Core: Ferrite; Tolerance: 30%; Shielding: Shielded; DC Resistance (DCR): 87 mOhm Max; Value: 4.7uH; Part Number: VLCF4024T-4R7N1R4-2; PartId: 16432; Supplier 1: Digi-Key; Supplier Part Number 1: 445-8737-2-ND; ComponentLink1Description: Datasheet; ComponentLink1URL: https://product.tdk.com/info/en/catalog/datasheets/inductor_commercial_power_vlcf4024-2_en.pdf; ComponentLink2Description: Digi-Key Listing; ComponentLink2URL: https://www.digikey.com/product-detail/en/tdk-corporation/VLCF4024T-4R7N1R4-2/445-8737-2-ND/3083279; Price: 0.441; Device Package: Nonstandard; Series: VLCF; Inductance: 4.7uH; Current Rating: 1.43A; Current - Saturation: 1.43A; Operating Temperature: -40C ~ 105C
L2 = VLCF4024T-100MR90-2: FIXED IND 10UH 900MA 136 MOHM; Manufacturer: TDK Corporation; Type: Wirewound; Material - Core: Ferrite; Tolerance: 20%; Shielding: Shielded; DC Resistance (DCR): 136 mOhm Max; Value: 10uH; Part Number: VLCF4024T-100MR90-2; PartId: 16429; Supplier 1: Digi-Key; Supplier Part Number 1: 445-8727-2-ND; ComponentLink1Description: Datasheet; ComponentLink1URL: https://product.tdk.com/info/en/catalog/datasheets/inductor_commercial_power_vlcf4024-2_en.pdf; ComponentLink2Description: Digi-Key Listing; ComponentLink2URL: https://www.digikey.com/product-detail/en/tdk-corporation/VLCF4024T-100MR90-2/445-8727-2-ND/3083281; Price: 0.441; Device Package: Nonstandard; Series: VLCF; Inductance: 10uH; Current Rating: 900mA; Current - Saturation: 900mA; Operating Temperature: -40C ~ 105C
ON = CL-SB-12B-01T: as BYP on sheet AnalogPressure; Part Number: CL-SB-12B-01T; PartId: 16472; Supplier 1: Digi-Key; Supplier Part Number 1: 563-1318-1-ND; ComponentLink1Description: Datasheet; ComponentLink1URL: https://www.nidec-copal-electronics.com/e/catalog/switch/cl-sb.pdf; ComponentLink2Description: Digi-Key Listing; ComponentLink2URL: https://www.digikey.com/product-detail/en/nidec-copal-electronics/CL-SB-12B-01T/563-1318-1-ND/3507878; Price: 0.9; TYPE: Slide Switches; Series: CL-SB; Circuit: SPDT; Operating Temperature: -40°C ~ 85°C
R6 R8 R15 = ERJ-8ENF1002V: as R5 on sheet InputConnectors; Value: 10k; Part Number: ERJ-8ENF1002V; PartId: 2956; Supplier 1: Digi-Key; Supplier Part Number 1: P10.0KFTR-ND; ComponentLink1Description: Datasheet; ComponentLink1URL: http://industrial.panasonic.com/www-cgi/jvcr13pz.cgi?E+PZ+3+AOA0002+ERJ8ENF1002V+7+WW; ComponentLink2Description: Digi-Key listing; ComponentLink2URL: http://digikey.com/product-detail/en/ERJ-8ENF1002V/P10.0KFTR-ND/89059; Tolerance: 1%; Price: 0.0093; Type: Thick Film; Device Package: 1206 (3216 Metric)
R7 R9 R10 R14 = ERJ-8ENF6200V: RES SMD 620 OHM 1% 1/4W 1206; Manufacturer: Panasonic Electronic Components; TemperatureRange: -55C ~ 155C; TemperatureCoefficient: 100ppm/C; PowerRating: 0.25W, 1/4W; Value: 620; Part Number: ERJ-8ENF6200V; PartId: 3356; Supplier 1: Digi-Key; Supplier Part Number 1: P620FTR-ND; ComponentLink1Description: Datasheet; ComponentLink1URL: http://industrial.panasonic.com/www-cgi/jvcr13pz.cgi?E+PZ+3+AOA0002+ERJ8ENF6200V+7+WW; ComponentLink2Description: Digi-Key listing; ComponentLink2URL: http://digikey.com/product-detail/en/ERJ-8ENF6200V/P620FTR-ND/1746078; Tolerance: 1%; Price: 0.0093; Type: Thick Film; Device Package: 1206 (3216 Metric)
RLY_F = 0022272021: CONN HEADER 2POS .100 VERT TIN; Manufacturer: Molex, LLC; Pitch: 0.100" (2.54mm); Number Of Positions: 2; Part Number: 0022272021; PartId: 9719; Supplier 1: Digi-Key; Supplier Part Number 1: WM4111-ND; ComponentLink1Description: Datasheet; ComponentLink1URL: http://www.molex.com/pdm_docs/sd/022272021_sd.pdf; ComponentLink2Description: Digi-Key Listing; ComponentLink2URL: http://www.digikey.com/product-search/en?keywords=22-27-2021; Price: 0.25; Type: Header, Unshrouded; Contact Finish: Tin; Fastening Type: Friction Lock; Number Of Rows: 1; Colour: Natural; Series: KK 6410
U4 = CMP-0859-00174-3: Single 2-Input Exclusive-OR Gate, DBV0005A, LARGE T&R; Manufacturer: Texas Instruments; Schmitt Trigger: No; Output Type: CMOS; Bits(#): 1; Rating: Catalog; Technology Family: LVC; VCC(Max)(V): 5.5; Input Type: CMOS/TTL; F @ Nom Voltage(Max)(Mhz): 150; Voltage(Nom)(V): 1.8,2.5,3.3,5; VCC(Min)(V): 1.65; Output Drive (IOL/IOH)(Max)(mA): 32/-32; ICC @ Nom Voltage(Max)(mA): 0.01; Logic: True; Sub-Family: XOR Gate; Gate Type: XOR; tpd @ Nom Voltage(Max)(ns): 9.9,5.5,5,4; Generic Part Number: SN74LVC1G86; DatasheetVersion: SCES222O; Operating Temperature Range(C): -40 to 125,-40 to 85; 3-State Output: No; PackageReference: DBV0005A
XF1 = CMP-1502-00234-1: WR-FSH Fuse Holder Blocks Fuse Holder Blocks Clip Cover for PCB; Manufacturer: Wurth Elektronik; Fuse Size: 5x20mm; Mounting Technology: THT; Publisher: WurthElektronik; Manufacturer URL: http://www.we-online.de; Package Reference: 696105003002; Part Number: 696105003002; Packaging: Box; Datasheet URL: https://katalog.we-online.de/em/datasheet/696105003002.pdf; Operating Temperature: -30to120degC

## Sheet BufferOut.SchDoc
size A
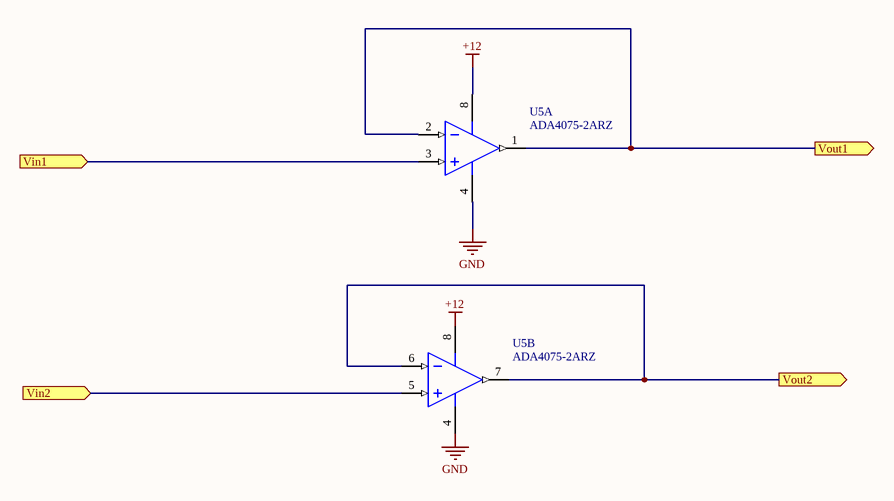
[diagram p6: BufferOut.SchDoc]

### Parts
U5  ADA4075-2ARZ  [ADI-R-8_N]  (parts A,B of 2)

### Ports
Vin1 (in), Vin2 (in), Vout1 (out), Vout2 (out)

### Nets
+12: U5.8(+V)
GND: U5.4(-V)
NetJ1_2: U5.3(+IN_A) ; port Vin1
NetJ2_1: U5.6(-IN_B) U5.7(OUT_B) ; port Vout2
NetJ2_2: U5.1(OUT_A) U5.2(-IN_A) ; port Vout1
NetR2_2: U5.5(+IN_B) ; port Vin2

### Library data of the parts
U5 = CMP-0384-00855-1: Double Channel Ultra Low Noise Operational Amplifier, 6.5 MHz BW, 12 V/us SR, Industrial, 8-pin SOIC (R-8), Tube; Manufacturer: Analog Devices; V Span Max: 36V; Small Signal Bandwidth: 6.5MHz; Input Bias Current: 30nA; V Span Min: 24V; Amplifiers Per Package: 2; Input Offset Voltage: 300uV; Slew Rate: 12V/us; Iq/Amp: 1.8mA; DatasheetVersion: Rev. B; PackageDescription: 8-Pin Standard Small Outline Package, Body 3.9 x 4.9 mm, Pitch 1.27 mm; Generic Part Number: ADA4075-2; PackageReference: R-8; ComponentLink3URL: http://www.analog.com/static/imported-files/packages/PKG_PDF/SOIC_Narrow%20(R)/R_8.pdf; ComponentLink2URL: http://www.analog.com/static/imported-files/data_sheets/ADA4075-2.pdf; ComponentLink3Description: Package Specification; ComponentLink1Description: Manufacturer URL; PartNumber: ADA4075-2ARZ; PackageVersion: 060506-A; ComponentLink2Description: Datasheet; Code_JEDEC: MS-012-AA; ComponentLink1URL: http://www.analog.com/en/index.html; Mounting Technology: Surface Mount

## Nets that join several sheets
+5: AnalogPressure (R1.2), InputConnectors (10 pins), Logic (C11.1 C14.1 U3.5 U3.14), FlipFlop (C4.2 R4.2 U2.8), IonValveCtrl (6 pins)
+12: AnalogPressure (BYP.3 C2.1 R2.3), InputConnectors (6 pins), BufferOut (U5.8)
GND: MainSch (J2.3), AnalogPressure (6 pins), InputConnectors (16 pins), Logic (8 pins), FlipFlop (5 pins), IonValveCtrl (10 pins), BufferOut (U5.4)
NetC5_1: InputConnectors (C5.1 J1.1), Logic (U3.2)
NetC12_1: Logic (C12.1 U3.6), FlipFlop (U2.2)
NetINT_SWITCH_2: InputConnectors (INT_SWITCH.2 R5.2), Logic (U3.4)
NetJ1_2: AnalogPressure (U1.3), InputConnectors (J1.2), BufferOut (U5.3)
NetJ2_1: MainSch (J2.1), BufferOut (U5.6 U5.7)
NetJ2_2: MainSch (J2.2), BufferOut (U5.1 U5.2)
NetR1_1: AnalogPressure (R1.1 R3.2 U1.7), Logic (U3.1)
NetR2_2: AnalogPressure (R2.2 R3.1 U1.2), BufferOut (U5.5)
ON/OFF: FlipFlop (U2.3), IonValveCtrl (IC2.3 IC3.1)